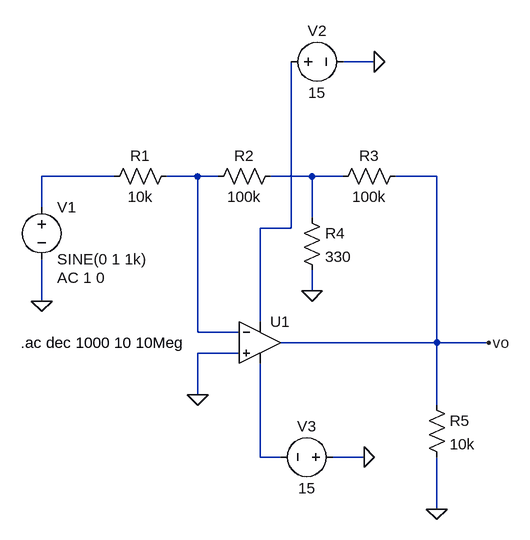
[diagram p0: schematic Ej1_a).asc]
Ej1_a).asc, the LTspice schematic file:
Version 4
SHEET 1 880 680
WIRE 304 -112 256 -112
WIRE -96 64 -208 64
WIRE 32 64 -16 64
WIRE 64 64 32 64
WIRE 208 64 144 64
WIRE 256 64 208 64
WIRE 400 64 336 64
WIRE -208 112 -208 64
WIRE 208 128 208 64
WIRE 176 144 176 -112
WIRE 176 144 128 144
WIRE 208 240 208 208
WIRE -208 256 -208 192
WIRE 128 288 128 144
WIRE 32 304 32 64
WIRE 96 304 32 304
WIRE 400 320 400 64
WIRE 400 320 160 320
WIRE 480 320 400 320
WIRE 96 336 32 336
WIRE 32 400 32 336
WIRE 400 416 400 320
WIRE 128 496 128 352
WIRE 160 496 128 496
WIRE 288 496 240 496
WIRE 400 576 400 496
FLAG 208 240 0
FLAG 32 400 0
FLAG 400 576 0
FLAG 480 320 vo
FLAG 304 -112 0
FLAG 288 496 0
FLAG -208 256 0
SYMBOL res 0 48 R90
WINDOW 0 0 56 VBottom 2
WINDOW 3 32 56 VTop 2
SYMATTR InstName R1
SYMATTR Value 10k
SYMBOL res 160 48 R90
WINDOW 0 0 56 VBottom 2
WINDOW 3 32 56 VTop 2
SYMATTR InstName R2
SYMATTR Value 100k
SYMBOL res 352 48 R90
WINDOW 0 0 56 VBottom 2
WINDOW 3 32 56 VTop 2
SYMATTR InstName R3
SYMATTR Value 100k
SYMBOL res 192 112 R0
SYMATTR InstName R4
SYMATTR Value 330
SYMBOL OpAmps\\UniversalOpAmp1 128 320 R0
SYMATTR InstName U1
SYMBOL res 384 400 R0
SYMATTR InstName R5
SYMATTR Value 10k
SYMBOL voltage -208 96 R0
WINDOW 123 24 124 Left 2
WINDOW 39 0 0 Left 0
SYMATTR InstName V1
SYMATTR Value SINE(0 1 1k)
SYMATTR Value2 AC 1 0
SYMBOL voltage 160 -112 R270
WINDOW 0 32 56 VTop 2
WINDOW 3 -32 56 VBottom 2
WINDOW 123 0 0 Left 0
WINDOW 39 0 0 Left 0
SYMATTR InstName V2
SYMATTR Value 15
SYMBOL voltage 256 496 R90
WINDOW 0 -32 56 VBottom 2
WINDOW 3 32 56 VTop 2
WINDOW 123 0 0 Left 0
WINDOW 39 0 0 Left 0
SYMATTR InstName V3
SYMATTR Value 15
TEXT -240 320 Left 2 !.ac dec 1000 10 10Meg

The netlist it stands for:
* Ej1_a).asc
R1 N002 N001 10k
R2 N003 N002 100k
R3 vo N003 100k
R4 N003 0 330
XU1 0 N002 N004 N005 vo level1 Avol=1Meg GBW=10Meg Vos=0 En=0 Enk=0 In=0 Ink=0 Rin=500Meg  ; pins In+ In- V+ V- OUT
R5 vo 0 10k
V1 N001 0 SINE(0 1 1k) AC 1 0
V2 N004 0 15
V3 0 N005 15
.ac dec 1000 10 10Meg
.lib UniversalOpAmp1.lib
.backanno
.end